# Altium schematic sheet HYDRA_V3_POWER.SchDoc
size C; SheetNumber: 1; SheetTotal: 9
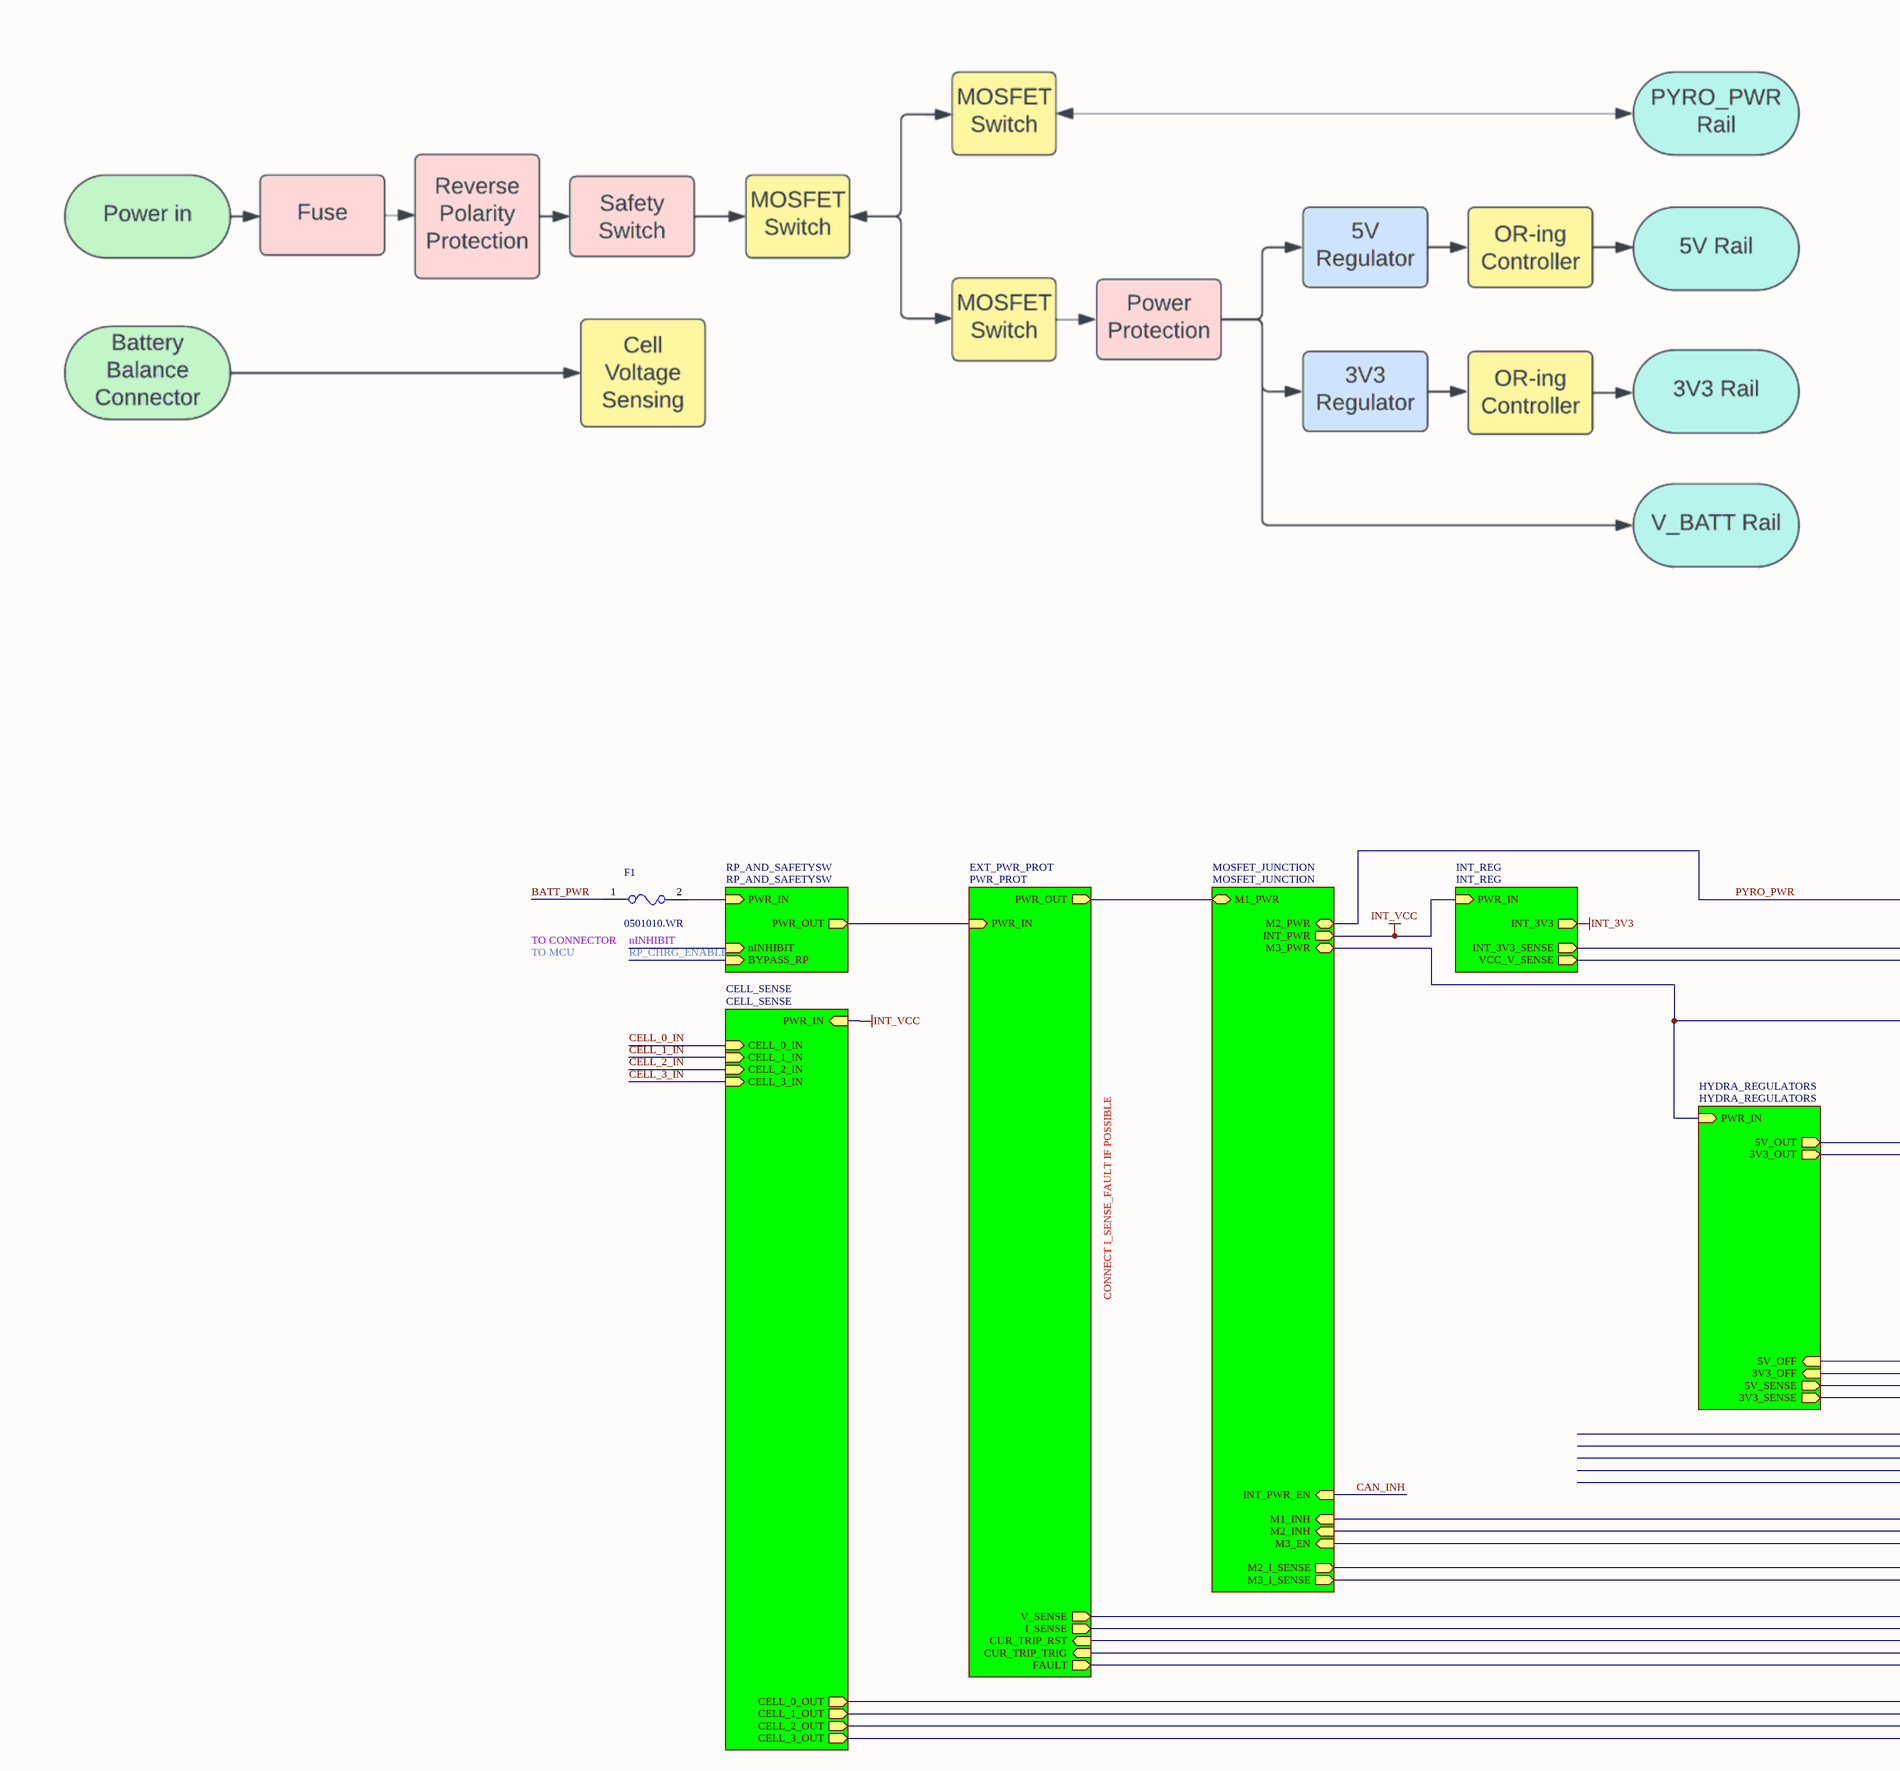
[diagram p0: HYDRA_V3_POWER.SchDoc, top left]
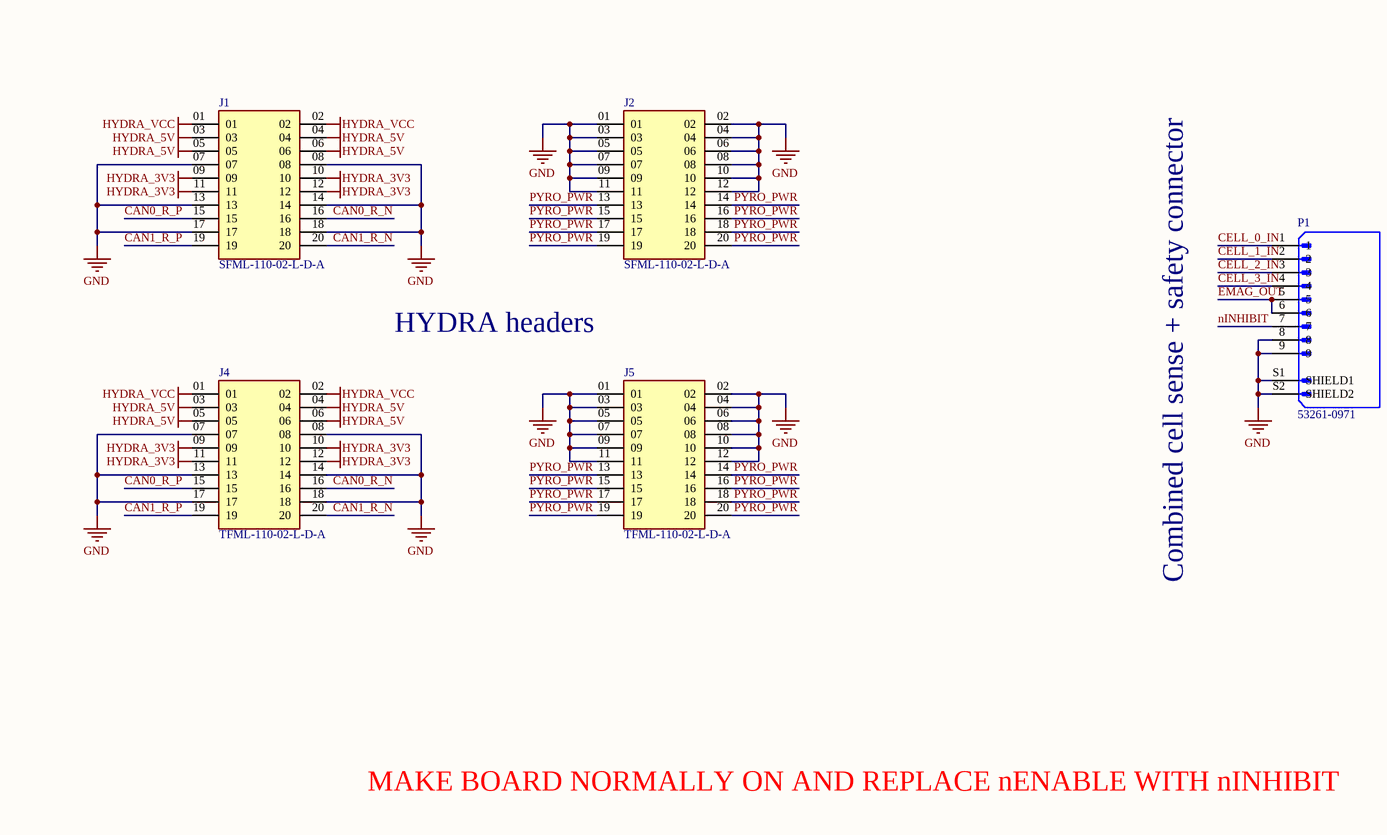
[diagram p1: HYDRA_V3_POWER.SchDoc, bottom left]
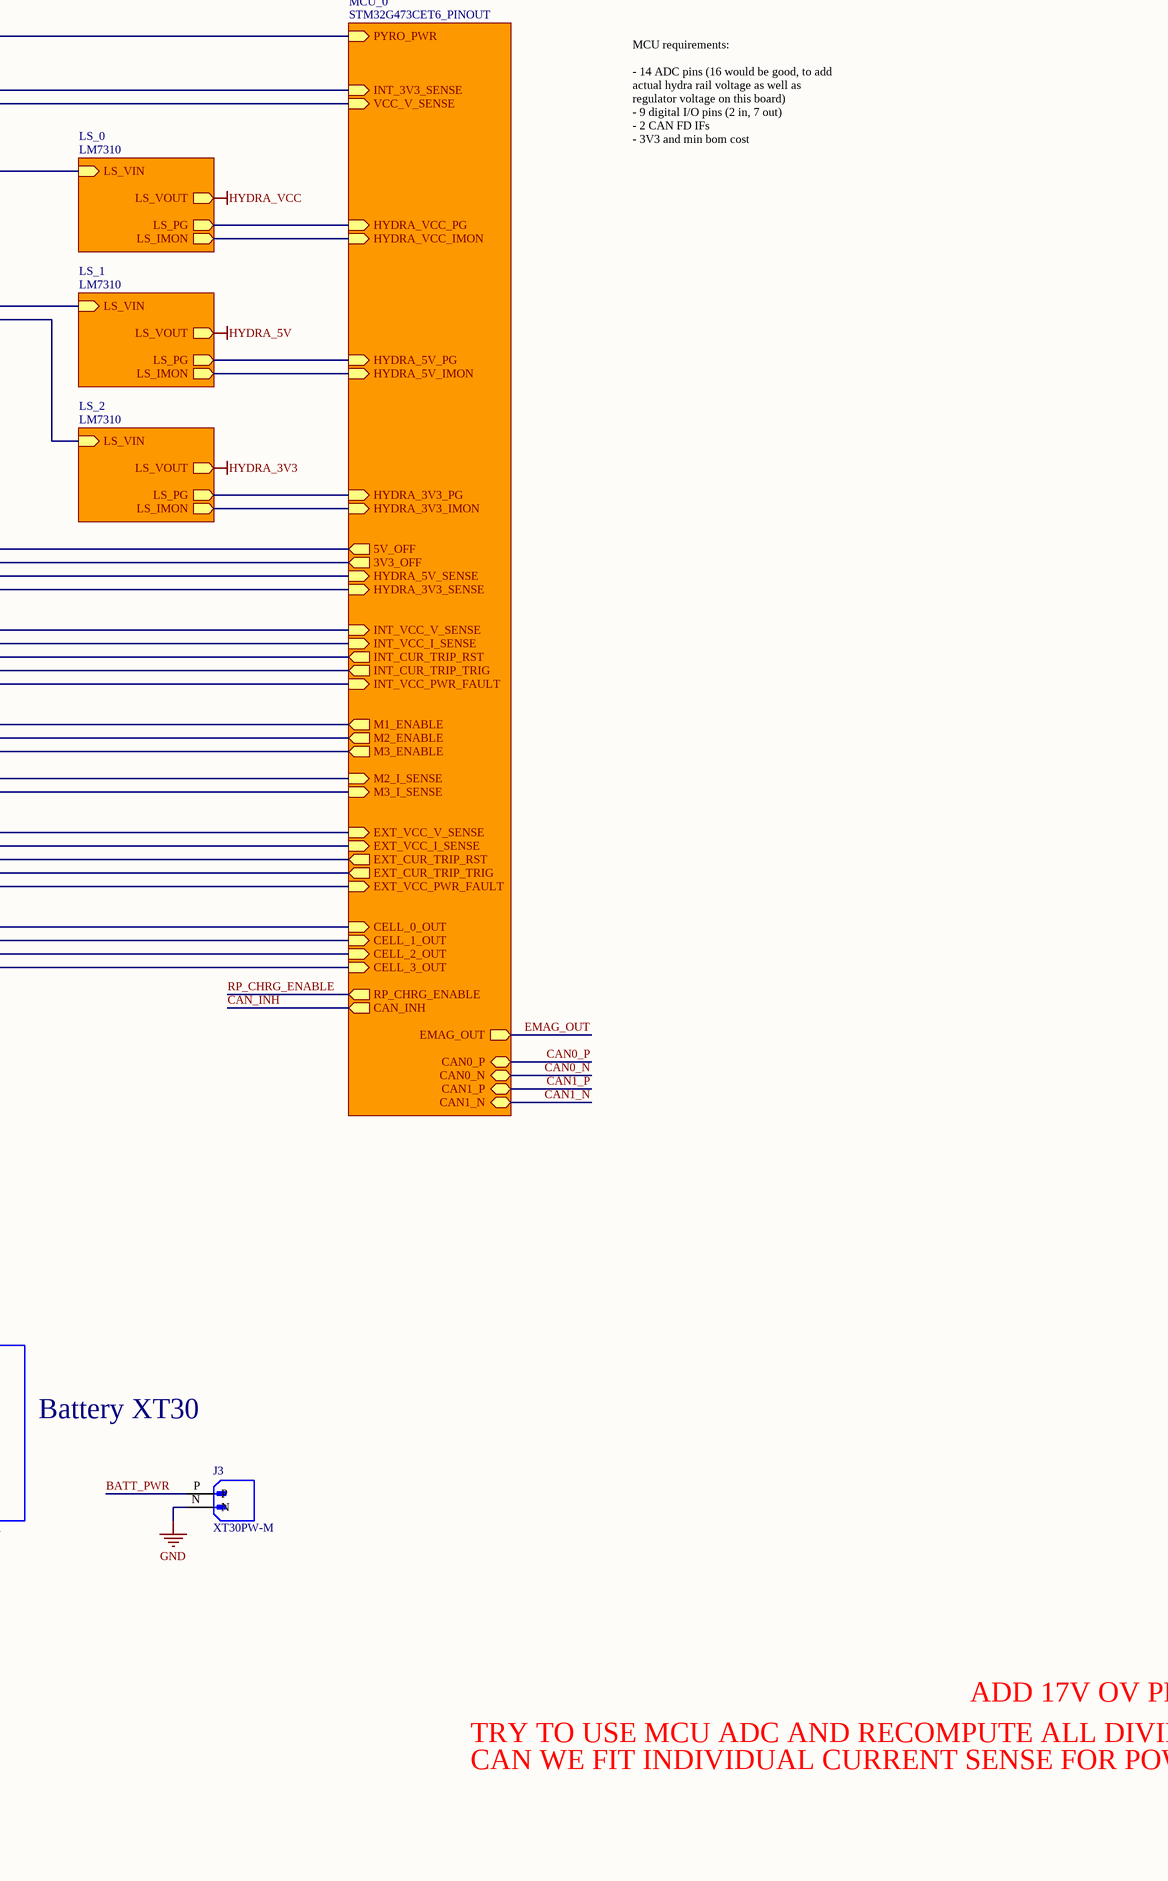
[diagram p2: HYDRA_V3_POWER.SchDoc, bottom right]

## Parts
F1  0501010.WR  [FP-0501-MFG]
J1  SFML-110-02-L-D-A  [SFML-110-02-L-D-A-Footprint-1]
J2  SFML-110-02-L-D-A  [SFML-110-02-L-D-A-Footprint-1]
J3  XT30PW-M  [XT30PW-M-Footprint-1]
J4  TFML-110-02-L-D-A  [TFML-110-02-L-D-A-Footprint-1]
J5  TFML-110-02-L-D-A  [TFML-110-02-L-D-A-Footprint-1]
P1  53261-0971  [53261-0971-Footprint-1]

## Sub-sheets
CELL_SENSE = CELL_SENSE: CELL_0_IN (in), CELL_1_IN (in), CELL_2_IN (in), CELL_3_IN (in), PWR_IN (in), CELL_0_OUT (out), CELL_1_OUT (out), CELL_2_OUT (out), CELL_3_OUT (out)
EXT_PWR_PROT = PWR_PROT: PWR_IN (in), PWR_OUT (out), V_SENSE (out), I_SENSE (out), CUR_TRIP_RST (in), CUR_TRIP_TRIG (in), FAULT (out)
HYDRA_REGULATORS = HYDRA_REGULATORS: PWR_IN (in), 5V_OUT (out), 3V3_OUT (out), 5V_SENSE (out), 3V3_SENSE (out), 5V_OFF (in), 3V3_OFF (in)
INT_REG = INT_REG: PWR_IN (in), INT_3V3 (out), INT_3V3_SENSE (out), VCC_V_SENSE (out)
LS_0 = LM7310: LS_VIN (in), LS_VOUT (out), LS_PG (out), LS_IMON (out)
LS_1 = LM7310: LS_VIN (in), LS_VOUT (out), LS_PG (out), LS_IMON (out)
LS_2 = LM7310: LS_VIN (in), LS_VOUT (out), LS_PG (out), LS_IMON (out)
MCU_0 = STM32G473CET6_PINOUT: PYRO_PWR (in), INT_3V3_SENSE (in), HYDRA_5V_SENSE (in), HYDRA_3V3_SENSE (in), INT_VCC_V_SENSE (in), INT_VCC_I_SENSE (in), INT_CUR_TRIP_RST (out), INT_CUR_TRIP_TRIG (out), INT_VCC_PWR_FAULT (in), M1_ENABLE (out), M2_ENABLE (out), M3_ENABLE (out), M2_I_SENSE (in), M3_I_SENSE (in), EXT_VCC_V_SENSE (in), EXT_VCC_I_SENSE (in), EXT_CUR_TRIP_RST (out), EXT_CUR_TRIP_TRIG (out), EXT_VCC_PWR_FAULT (in), CELL_0_OUT (in), CELL_1_OUT (in), CELL_2_OUT (in), CELL_3_OUT (in), RP_CHRG_ENABLE (out), VCC_V_SENSE (in), 5V_OFF (out), 3V3_OFF (out), CAN0_P (bidir), CAN0_N (bidir), CAN1_P (bidir), CAN1_N (bidir), HYDRA_5V_PG (in), HYDRA_5V_IMON (in), HYDRA_3V3_PG (in), HYDRA_3V3_IMON (in), HYDRA_VCC_PG (in), HYDRA_VCC_IMON (in), EMAG_OUT (out), CAN_INH (out)
MOSFET_JUNCTION = MOSFET_JUNCTION: M1_PWR (bidir), M2_PWR (bidir), M3_PWR (bidir), INT_PWR (out), M2_I_SENSE (out), M3_I_SENSE (out), M2_INH (in), M1_INH (in), M3_EN (in), INT_PWR_EN (in)
RP_AND_SAFETYSW = RP_AND_SAFETYSW: PWR_IN (in), PWR_OUT (out), nINHIBIT (in), BYPASS_RP (in)

## Nets
GND: J1.07 J1.08 J1.13 J1.14 J1.17 J1.18 J2.01 J2.02 J2.03 J2.04 J2.05 J2.06 J2.07 J2.08 J2.09 J2.10 J2.11 J2.12 J3.N J4.07 J4.08 J4.13 J4.14 J4.17 J4.18 J5.01 J5.02 J5.03 J5.04 J5.05 J5.06 J5.07 J5.08 J5.09 J5.10 J5.11 J5.12 P1.8 P1.9 P1.S1(SHIELD1) P1.S2(SHIELD2)
HYDRA_3V3: J1.09 J1.10 J1.11 J1.12 J4.09 J4.10 J4.11 J4.12 ; sheet LS_2/LS_VOUT
HYDRA_5V: J1.03 J1.04 J1.05 J1.06 J4.03 J4.04 J4.05 J4.06 ; sheet LS_1/LS_VOUT
HYDRA_VCC: J1.01 J1.02 J4.01 J4.02 ; sheet LS_0/LS_VOUT
INT_3V3: sheet INT_REG/INT_3V3
INT_VCC: sheet CELL_SENSE/PWR_IN, sheet MOSFET_JUNCTION/INT_PWR, sheet INT_REG/PWR_IN
BATT_PWR: F1.1 J3.P
CAN0_N: sheet MCU_0/CAN0_N
CAN0_P: sheet MCU_0/CAN0_P
CAN0_R_N: J1.16 J4.16
CAN0_R_P: J1.15 J4.15
CAN1_N: sheet MCU_0/CAN1_N
CAN1_P: sheet MCU_0/CAN1_P
CAN1_R_N: J1.20 J4.20
CAN1_R_P: J1.19 J4.19
CAN_INH: sheet MCU_0/CAN_INH, sheet MOSFET_JUNCTION/INT_PWR_EN
CELL_0_IN: P1.1 ; sheet CELL_SENSE/CELL_0_IN
CELL_1_IN: P1.2 ; sheet CELL_SENSE/CELL_1_IN
CELL_2_IN: P1.3 ; sheet CELL_SENSE/CELL_2_IN
CELL_3_IN: P1.4 ; sheet CELL_SENSE/CELL_3_IN
EMAG_OUT: P1.5 P1.6 ; sheet MCU_0/EMAG_OUT
nINHIBIT: P1.7 ; sheet RP_AND_SAFETYSW/nINHIBIT
PYRO_PWR: J2.13 J2.14 J2.15 J2.16 J2.17 J2.18 J2.19 J2.20 J5.13 J5.14 J5.15 J5.16 J5.17 J5.18 J5.19 J5.20 ; sheet MCU_0/PYRO_PWR, sheet MOSFET_JUNCTION/M2_PWR
RP_CHRG_ENABLE: sheet MCU_0/RP_CHRG_ENABLE, sheet RP_AND_SAFETYSW/BYPASS_RP
NetF1_2: F1.2 ; sheet RP_AND_SAFETYSW/PWR_IN
(unnamed): sheet MCU_0/INT_3V3_SENSE, sheet INT_REG/INT_3V3_SENSE
(unnamed): sheet MCU_0/HYDRA_5V_SENSE, sheet HYDRA_REGULATORS/5V_SENSE
(unnamed): sheet MCU_0/HYDRA_3V3_SENSE, sheet HYDRA_REGULATORS/3V3_SENSE
(unnamed): sheet MCU_0/M1_ENABLE, sheet MOSFET_JUNCTION/M1_INH
(unnamed): sheet MCU_0/M2_ENABLE, sheet MOSFET_JUNCTION/M2_INH
(unnamed): sheet MCU_0/M3_ENABLE, sheet MOSFET_JUNCTION/M3_EN
(unnamed): sheet MCU_0/M2_I_SENSE, sheet MOSFET_JUNCTION/M2_I_SENSE
(unnamed): sheet MCU_0/M3_I_SENSE, sheet MOSFET_JUNCTION/M3_I_SENSE
(unnamed): sheet MCU_0/EXT_VCC_V_SENSE, sheet EXT_PWR_PROT/V_SENSE
(unnamed): sheet MCU_0/EXT_VCC_I_SENSE, sheet EXT_PWR_PROT/I_SENSE
(unnamed): sheet MCU_0/EXT_CUR_TRIP_RST, sheet EXT_PWR_PROT/CUR_TRIP_RST
(unnamed): sheet MCU_0/EXT_CUR_TRIP_TRIG, sheet EXT_PWR_PROT/CUR_TRIP_TRIG
(unnamed): sheet MCU_0/EXT_VCC_PWR_FAULT, sheet EXT_PWR_PROT/FAULT
(unnamed): sheet MCU_0/CELL_0_OUT, sheet CELL_SENSE/CELL_0_OUT
(unnamed): sheet MCU_0/CELL_1_OUT, sheet CELL_SENSE/CELL_1_OUT
(unnamed): sheet MCU_0/CELL_2_OUT, sheet CELL_SENSE/CELL_2_OUT
(unnamed): sheet MCU_0/CELL_3_OUT, sheet CELL_SENSE/CELL_3_OUT
(unnamed): sheet MCU_0/VCC_V_SENSE, sheet INT_REG/VCC_V_SENSE
(unnamed): sheet MCU_0/5V_OFF, sheet HYDRA_REGULATORS/5V_OFF
(unnamed): sheet MCU_0/3V3_OFF, sheet HYDRA_REGULATORS/3V3_OFF
(unnamed): sheet MCU_0/HYDRA_5V_PG, sheet LS_1/LS_PG
(unnamed): sheet MCU_0/HYDRA_5V_IMON, sheet LS_1/LS_IMON
(unnamed): sheet MCU_0/HYDRA_3V3_PG, sheet LS_2/LS_PG
(unnamed): sheet MCU_0/HYDRA_3V3_IMON, sheet LS_2/LS_IMON
(unnamed): sheet MCU_0/HYDRA_VCC_PG, sheet LS_0/LS_PG
(unnamed): sheet MCU_0/HYDRA_VCC_IMON, sheet LS_0/LS_IMON
(unnamed): sheet EXT_PWR_PROT/PWR_IN, sheet RP_AND_SAFETYSW/PWR_OUT
(unnamed): sheet EXT_PWR_PROT/PWR_OUT, sheet MOSFET_JUNCTION/M1_PWR
(unnamed): sheet MOSFET_JUNCTION/M3_PWR, sheet HYDRA_REGULATORS/PWR_IN, sheet LS_0/LS_VIN
(unnamed): sheet HYDRA_REGULATORS/5V_OUT, sheet LS_1/LS_VIN
(unnamed): sheet HYDRA_REGULATORS/3V3_OUT, sheet LS_2/LS_VIN

## Notes on the sheet
- TO MCU
- (near F1) TO CONNECTOR
- MCU requirements:
  - 14 ADC pins (16 would be good, to add actual hydra rail voltage as well as regulator voltage on this board)
  - 9 digital I/O pins (2 in, 7 out)
  - 2 CAN FD IFs
  - 3V3 and min bom cost
- CONNECT I_SENSE_FAULT IF POSSIBLE
- HYDRA headers
- Battery XT30
- Combined cell sense + safety connector
- ADD 17V OV PROT
- TRY TO USE MCU ADC AND RECOMPUTE ALL DIVIDERS/UP RESISTANCE
- CAN WE FIT INDIVIDUAL CURRENT SENSE FOR POWER BOARD CONTRIBUTION TO HYDRA 5V AND 3V3
- MAKE BOARD NORMALLY ON AND REPLACE nENABLE WITH nINHIBIT

## Library data of the parts
F1 = CMP-08605-000084-1: FUSE BOARD MOUNT 10A 32VDC 1206; Working Voltage: 32V; Approvals: UL; Fuse Type: Board Mount (Cartridge Style Excluded); DC Cold Resistance: 4.27mR; Depth: 1.63mm; Housing Material: Ceramic; Max Operating Temperature: 150°C; Voltage Rating (DC): 32V; Width: 1.63mm; Height: 0.033inch; Current Rating: 10A; Composition: Ceramic; Lead Free: Lead Free; Case Code (Metric): 3216; Min Operating Temperature: -55°C; Packaging: Tape and Reel; Mount: Surface Mount; Case/Package: 1206; Case Code (Imperial): 1206; Package Quantity: 3000; Length: 3.2mm
J1 J2 = CMP-002-00043-1: Board Connector, 20 Contact(s), 2 Row(s), Female, Straight, 0.05 inch Pitch, Surface Mount Terminal, Locking, Black Insulator, Socket; RoHS Compliant: Yes; Connector Type: BOARD CONNECTOR; Mounting Technology: Board
J3 = CMP-002-00064-1
J4 J5 = CMP-002-00042-1: Board Connector, 20 Contact(s), 2 Row(s), Male, Straight, Surface Mount Terminal; Connector Type: BOARD CONNECTOR; Mounting Technology: Board; RoHS Compliant: Yes
P1 = CMP-002-00065-2: Board Connector, 9 Contact(s), 1 Row(s), Male, Right Angle, 0.049 inch Pitch, Surface Mount Terminal, Locking, Natural Insulator, Receptacle; Connector Type: BOARD CONNECTOR; Max Operating Temperature: 85°C; Mounting Technology: Board; Min Operating Temperature: -40°C; RoHS Compliant: Yes